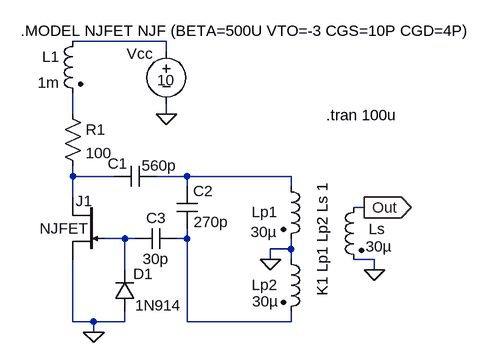
[diagram p0: schematic HartleyNjfet.asc]
HartleyNjfet.asc, the LTspice schematic file:
Version 4
SHEET 1 880 680
WIRE -112 144 -112 112
WIRE -112 240 -112 224
WIRE -112 272 -112 240
WIRE -112 464 -112 368
WIRE -80 464 -112 464
WIRE -80 480 -80 464
WIRE -48 240 -112 240
WIRE -32 336 -64 336
WIRE -32 384 -32 336
WIRE -32 464 -80 464
WIRE -32 464 -32 448
WIRE -16 336 -32 336
WIRE 32 32 -112 32
WIRE 32 48 32 32
WIRE 32 144 32 128
WIRE 64 240 16 240
WIRE 64 256 64 240
WIRE 64 336 48 336
WIRE 64 336 64 320
WIRE 64 464 64 336
WIRE 192 368 192 352
WIRE 224 240 64 240
WIRE 224 256 224 240
WIRE 224 352 192 352
WIRE 224 352 224 336
WIRE 224 368 224 352
WIRE 224 464 64 464
WIRE 224 464 224 448
WIRE 336 288 320 288
WIRE 352 368 320 368
WIRE 352 384 352 368
FLAG -80 480 0
FLAG 192 368 0
FLAG 352 384 0
FLAG 336 288 Out
IOPIN 336 288 Out
FLAG 32 144 0
SYMBOL njf -64 272 M0
WINDOW 0 18 6 Left 0
WINDOW 3 24 48 Left 0
SYMATTR InstName J1
SYMATTR Value NJFET
SYMBOL diode -16 448 R180
WINDOW 0 -28 58 Left 0
WINDOW 3 -71 9 Left 0
SYMATTR InstName D1
SYMATTR Value 1N914
SYMBOL res -128 128 R0
SYMATTR InstName R1
SYMATTR Value 100
SYMBOL ind2 -96 16 M0
SYMATTR InstName L1
SYMATTR Value 1m
SYMATTR Type ind
SYMBOL cap 16 224 R90
WINDOW 0 12 59 VBottom 0
WINDOW 3 -16 -5 VTop 0
SYMATTR InstName C1
SYMATTR Value 560p
SYMBOL cap 80 320 R180
WINDOW 0 -24 57 Left 0
WINDOW 3 -48 10 Left 0
SYMATTR InstName C2
SYMATTR Value 270p
SYMBOL cap 48 320 R90
WINDOW 0 0 32 VBottom 0
WINDOW 3 32 32 VTop 0
SYMATTR InstName C3
SYMATTR Value 30p
SYMBOL ind2 208 240 R0
WINDOW 0 -45 55 Left 0
WINDOW 3 -46 86 Left 0
SYMATTR InstName Lp1
SYMATTR Value 30µ
SYMATTR Type ind
SYMBOL ind2 208 352 R0
WINDOW 0 -45 55 Left 0
WINDOW 3 -44 81 Left 0
SYMATTR InstName Lp2
SYMATTR Value 30µ
SYMATTR Type ind
SYMBOL ind2 336 272 M0
WINDOW 0 -33 49 Left 0
WINDOW 3 -43 76 Left 0
SYMATTR InstName Ls
SYMATTR Value 30µ
SYMATTR Type ind
SYMBOL voltage 32 32 R0
WINDOW 0 -61 19 Left 0
WINDOW 3 -14 60 Left 0
SYMATTR InstName Vcc
SYMATTR Value 10
TEXT -192 16 Left 0 !.MODEL NJFET NJF (BETA=500U VTO=-3 CGS=10P CGD=4P)
TEXT 272 248 VRight 0 !K1 Lp1 Lp2 Ls 1
TEXT 278 146 Left 0 !.tran 100u

The netlist it stands for:
* HartleyNjfet.asc
J1 N002 N003 0 NJFET
D1 0 N003 1N914
R1 N001 N002 100
L1 N004 N001 1m
C1 N005 N002 560p
C2 N006 N005 270p
C3 N006 N003 30p
Lp1 N005 0 30µ
Lp2 0 N006 30µ
Ls Out 0 30µ
Vcc N004 0 10
.model D D
.lib standard.dio
.model NJF NJF
.model PJF PJF
.lib standard.jft
.MODEL NJFET NJF (BETA=500U VTO=-3 CGS=10P CGD=4P)
K1 Lp1 Lp2 Ls 1
.tran 100u
.backanno
.end